# Altium schematic sheet OTHER.SchDoc
size 420 x 297 mm; SheetNumber: 2; SheetTotal: 2
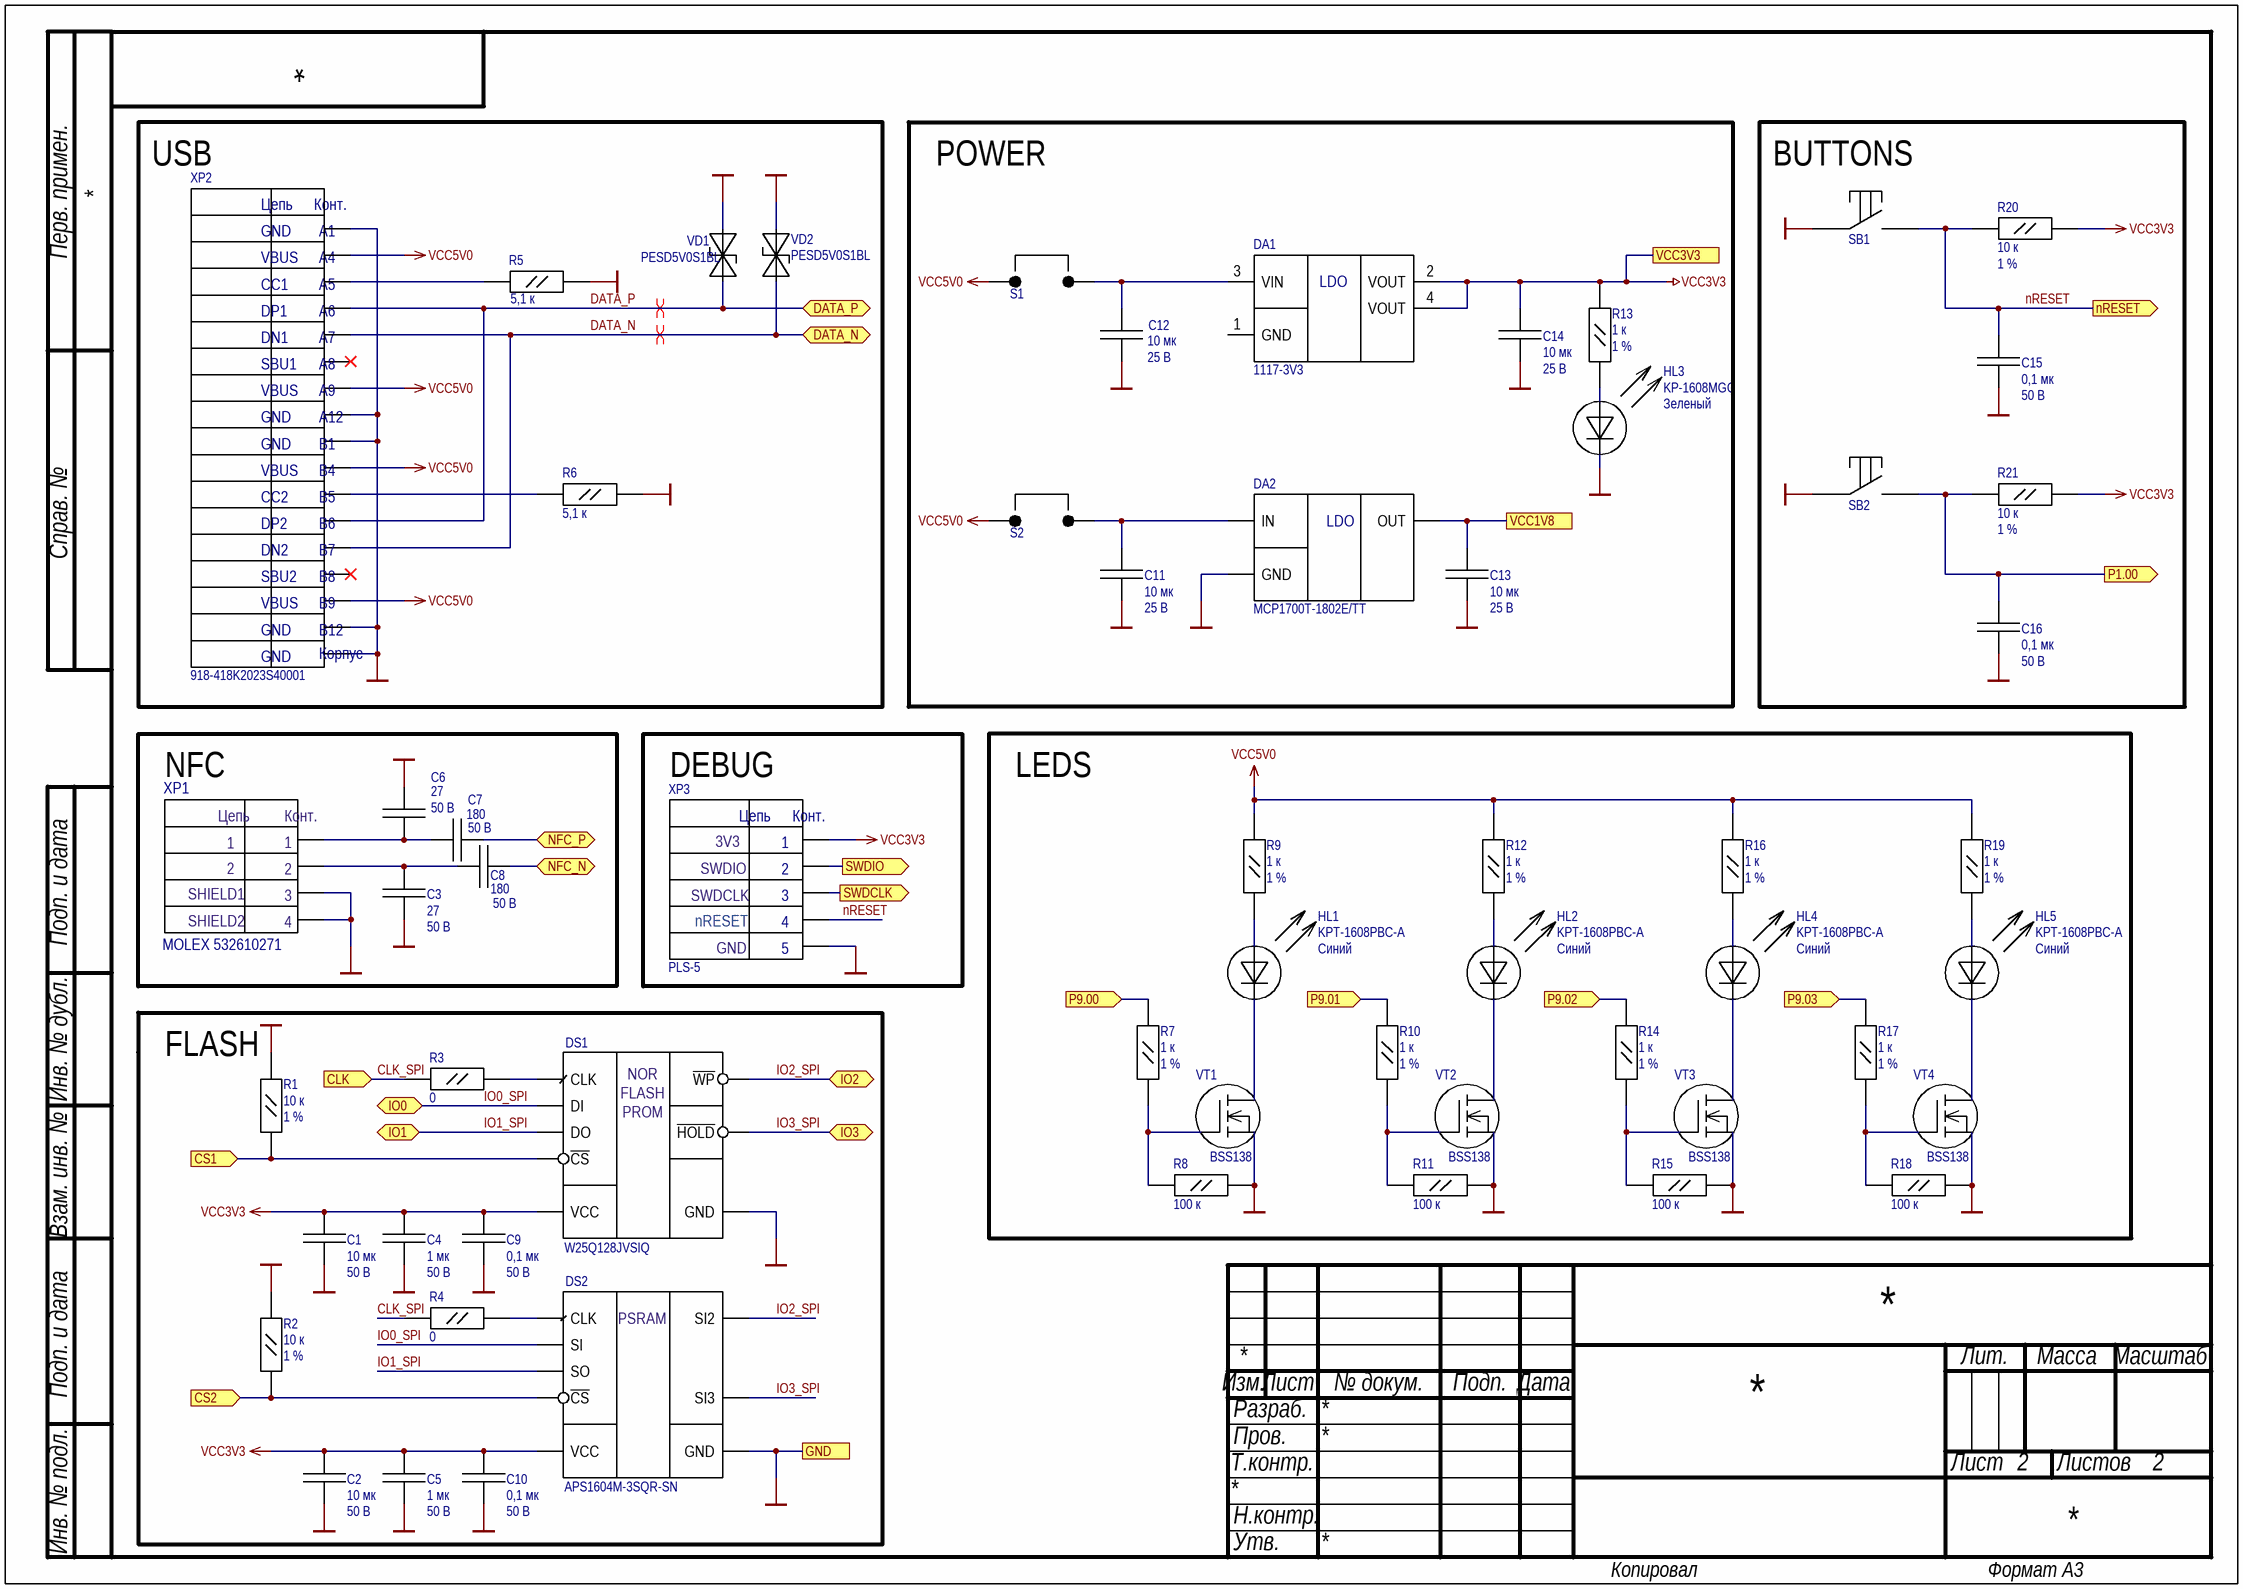
[diagram p0: OTHER.SchDoc]

## Parts
C1  value 10 мк  Rated voltage: 50 В  [C_1210_Manual_mount]  (hidden comment: GRM32ER61H106MA12)
C2  value 10 мк  Rated voltage: 50 В  [C_1210_Manual_mount]  (hidden comment: GRM32ER61H106MA12)
C3  value 27  Rated voltage: 50 В  [C_0603_Manual_mount]  (hidden comment: GRM1885C1H270JA01)
C4  value 1 мк  Rated voltage: 50 В  [C_1206_Manual_mount]  (hidden comment: GRM31MR71H105KA88)
C5  value 1 мк  Rated voltage: 50 В  [C_1206_Manual_mount]  (hidden comment: GRM31MR71H105KA88)
C6  value 27  Rated voltage: 50 В  [C_0603_Manual_mount]  (hidden comment: GRM1885C1H270JA01)
C7  value 180  Rated voltage: 50 В  [C_0603_Manual_mount]  (hidden comment: GRM1885C1H181JA01)
C8  value 180  Rated voltage: 50 В  [C_0603_Manual_mount]  (hidden comment: GRM1885C1H181JA01)
C9  value 0,1 мк  Rated voltage: 50 В  [C_0603_Manual_mount]  (hidden comment: GRM188R71H104KA93)
C10  value 0,1 мк  Rated voltage: 50 В  [C_0603_Manual_mount]  (hidden comment: GRM188R71H104KA93)
C11  value 10 мк  Rated voltage: 25 В  [C_0603_Manual_mount]  (hidden comment: GRM188R61E106MA73)
C12  value 10 мк  Rated voltage: 25 В  [C_0603_Manual_mount]  (hidden comment: GRM188R61E106MA73)
C13  value 10 мк  Rated voltage: 25 В  [C_0603_Manual_mount]  (hidden comment: GRM188R61E106MA73)
C14  value 10 мк  Rated voltage: 25 В  [C_0603_Manual_mount]  (hidden comment: GRM188R61E106MA73)
C15  value 0,1 мк  Rated voltage: 50 В  [C_0603_Manual_mount]  (hidden comment: GRM188R71H104KA93)
C16  value 0,1 мк  Rated voltage: 50 В  [C_0603_Manual_mount]  (hidden comment: GRM188R71H104KA93)
DA1  1117-3V3  [SOT-223]
DA2  MCP1700T-1802E/TT  [SOT-23]
DS1  W25Q128JVSIQ  [SOIC127P790X216-8N]
DS2  APS1604M-3SQR-SN  [APS1604M (SOP-8)]
HL1  KPT-1608PBC-A  Color: Синий  [LED_0603_Blue_Auto_mount]
HL2  KPT-1608PBC-A  Color: Синий  [LED_0603_Blue_Auto_mount]
HL3  KP-1608MGC  Color: Зеленый  [LED_0603_Green_Auto_mount]
HL4  KPT-1608PBC-A  Color: Синий  [LED_0603_Blue_Auto_mount]
HL5  KPT-1608PBC-A  Color: Синий  [LED_0603_Blue_Auto_mount]
R1  value 10 к  Tolerance: 1 %  [R_0603_Manual_mount]  (hidden comment: RC0603FR-0710KL)
R2  value 10 к  Tolerance: 1 %  [R_0603_Manual_mount]  (hidden comment: RC0603FR-0710KL)
R3  value 0  [R_0603_Manual_mount]  (hidden comment: RC0603JR-070RL)
R4  value 0  [R_0603_Manual_mount]  (hidden comment: RC0603JR-070RL)
R5  value 5,1 к  [R_0603_Manual_mount]  (hidden comment: RC0603JR-075K1L)
R6  value 5,1 к  [R_0603_Manual_mount]  (hidden comment: RC0603JR-075K1L)
R7  value 1 к  Tolerance: 1 %  [R_0603_Manual_mount]  (hidden comment: RC0603FR-071KL)
R8  value 100 к  [R_0603_Manual_mount]  (hidden comment: RC0603JR-07100KL)
R9  value 1 к  Tolerance: 1 %  [R_0603_Manual_mount]  (hidden comment: RC0603FR-071KL)
R10  value 1 к  Tolerance: 1 %  [R_0603_Manual_mount]  (hidden comment: RC0603FR-071KL)
R11  value 100 к  [R_0603_Manual_mount]  (hidden comment: RC0603JR-07100KL)
R12  value 1 к  Tolerance: 1 %  [R_0603_Manual_mount]  (hidden comment: RC0603FR-071KL)
R13  value 1 к  Tolerance: 1 %  [R_0603_Manual_mount]  (hidden comment: RC0603FR-071KL)
R14  value 1 к  Tolerance: 1 %  [R_0603_Manual_mount]  (hidden comment: RC0603FR-071KL)
R15  value 100 к  [R_0603_Manual_mount]  (hidden comment: RC0603JR-07100KL)
R16  value 1 к  Tolerance: 1 %  [R_0603_Manual_mount]  (hidden comment: RC0603FR-071KL)
R17  value 1 к  Tolerance: 1 %  [R_0603_Manual_mount]  (hidden comment: RC0603FR-071KL)
R18  value 100 к  [R_0603_Manual_mount]  (hidden comment: RC0603JR-07100KL)
R19  value 1 к  Tolerance: 1 %  [R_0603_Manual_mount]  (hidden comment: RC0603FR-071KL)
R20  value 10 к  Tolerance: 1 %  [R_0603_Manual_mount]  (hidden comment: RC0603FR-0710KL)
R21  value 10 к  Tolerance: 1 %  [R_0603_Manual_mount]  (hidden comment: RC0603FR-0710KL)
S1  0  [Wedge Jumper 0603]  (value not drawn)  (no BOM)
S2  0  [Wedge Jumper 0603]  (value not drawn)  (no BOM)
SB1  Tact_switch  [Tact_switch_6x6x4.3]  (value not drawn)
SB2  Tact_switch  [Tact_switch_6x6x4.3]  (value not drawn)
VD1  PESD5V0S1BL  [SOD-882]
VD2  PESD5V0S1BL  [SOD-882]
VT1  BSS138  [SOT-23]
VT2  BSS138  [SOT-23]
VT3  BSS138  [SOT-23]
VT4  BSS138  [SOT-23]
XP1  MOLEX 532610271  [MOLEX_532610271]
XP2  918-418K2023S40001  [918-418K2023S40001]
XP3  PLS-5  [PLS-5]

## Blocks framed on the sheet
USB: R5 R6 VD1 VD2 XP2
POWER: C11-C14 DA1 DA2 HL3 R13 S1 S2
BUTTONS: C15 C16 R20 R21 SB1 SB2
NFC: C3 C6-C8 XP1
DEBUG: XP3
LEDS: HL1 HL2 HL4 HL5 R7-R12 R14-R19 VT1-VT4
FLASH: C1 C2 C4 C5 C9 C10 DS1 DS2 R1-R4

## Ports
CLK (in, see MCU+GPIO), CS1 (in, see MCU+GPIO), CS2 (in, see MCU+GPIO), DATA_N (bidir, see MCU+GPIO), DATA_P (bidir, see MCU+GPIO), GND (see MCU+GPIO), IO0 (bidir, see MCU+GPIO), IO1 (bidir, see MCU+GPIO), IO2 (bidir, see MCU+GPIO), IO3 (bidir, see MCU+GPIO), NFC_N (bidir, see MCU+GPIO), NFC_P (bidir, see MCU+GPIO), nRESET (out, see MCU+GPIO), P1.00 (out, see MCU+GPIO), P9.00 (in, see MCU+GPIO), P9.01 (in, see MCU+GPIO), P9.02 (in, see MCU+GPIO), P9.03 (in, see MCU+GPIO), SWDCLK (out, see MCU+GPIO), SWDIO (out, see MCU+GPIO), VCC1V8 (see MCU+GPIO), VCC3V3 (see MCU+GPIO)

## Nets
GND: C1.2 C2.2 C3.2 C4.2 C5.2 C6.1 C9.2 C10.2 C11.2 C12.2 C13.2 C14.2 C15.2 C16.2 DA2.1(GND) DS1.4(GND) DS2.4(GND) HL3.C R1.2 R2.2 R5.2 R6.2 R8.2 R11.2 R15.2 R18.2 SB1.1 SB2.1 VD1.1 VD2.1 VT1.2(S) VT2.2(S) VT3.2(S) VT4.2(S) XP1.S1(SHIELD1) XP1.S2(SHIELD2) XP2.0 XP2.A1 XP2.A12 XP2.B1 XP2.B12 XP3.5 ; port GND
VCC3V3: C1.1 C2.1 C4.1 C5.1 C9.1 C10.1 C14.1 DA1.2(VOUT) DA1.4(VOUT) DS1.8(VCC) DS2.8(VCC) R13.1 R20.2 R21.2 XP3.1 ; port VCC3V3
VCC5V0: R9.1 R12.1 R16.1 R19.1 S1.1 S2.1 XP2.A4 XP2.A9 XP2.B4 XP2.B9
CLK_SPI: R3.1 R4.1 ; port CLK
CS1: DS1.1(~{CS}) R1.1 ; port CS1
CS2: DS2.1(~{CS}) R2.1 ; port CS2
DATA_N: VD2.2 XP2.A7 XP2.B7 ; port DATA_N
DATA_P: VD1.2 XP2.A6 XP2.B6 ; port DATA_P
IO0_SPI: DS1.5(DI) DS2.5(SI) ; port IO0
IO1_SPI: DS1.2(DO) DS2.2(SO) ; port IO1
IO2_SPI: DS1.3(~{WP}) DS2.3(SI2) ; port IO2
IO3_SPI: DS1.7(~{HOLD}) DS2.7(SI3) ; port IO3
NFC_N: C8.1 ; port NFC_N
NFC_P: C7.1 ; port NFC_P
nRESET: C15.1 R20.1 SB1.2 XP3.4 ; port nRESET
P1.00: C16.1 R21.1 SB2.2 ; port P1.00
P9.00: R7.1 ; port P9.00
P9.01: R10.1 ; port P9.01
P9.02: R14.1 ; port P9.02
P9.03: R17.1 ; port P9.03
SWDCLK: XP3.3 ; port SWDCLK
SWDIO: XP3.2 ; port SWDIO
VCC1V8: C13.1 DA2.2(OUT) ; port VCC1V8
NetC3_1: C3.1 C8.2 XP1.2
NetC6_2: C6.2 C7.2 XP1.1
NetC11_1: C11.1 DA2.3(IN) S2.2
NetC12_1: C12.1 DA1.3(VIN) S1.2
NetDS1_6: DS1.6(CLK) R3.2
NetDS2_6: DS2.6(CLK) R4.2
NetHL1_A: HL1.A R9.2
NetHL1_C: HL1.C VT1.3(D)
NetHL2_A: HL2.A R12.2
NetHL2_C: HL2.C VT2.3(D)
NetHL3_A: HL3.A R13.2
NetHL4_A: HL4.A R16.2
NetHL4_C: HL4.C VT3.3(D)
NetHL5_A: HL5.A R19.2
NetHL5_C: HL5.C VT4.3(D)
NetR5_1: R5.1 XP2.A5
NetR6_1: R6.1 XP2.B5
NetR7_2: R7.2 R8.1 VT1.1(G)
NetR10_2: R10.2 R11.1 VT2.1(G)
NetR14_2: R14.2 R15.1 VT3.1(G)
NetR17_2: R17.2 R18.1 VT4.1(G)

Not connected (* = marked no-connect by the designer): DA1 1(GND); XP2 A8* B8*

## Layout directives
differential pair; differential pair class USB: DATA_N, DATA_P

## Notes on the sheet
- 1
- 3V3
- (near XP1) SHIELD1
- (near XP1) SHIELD2
- 2
- SWDCLK
- nRESET
- SWDIO
- GND
- Перв. примен.
- Справ. №
- Подп. и дата
- Инв. № дубл.
- Взам. инв. №
- Изм.
- Лист
- № докум.
- Подп.
- Дата
- Лит.
- Масса
- Масштаб
- Т.контр.
- Пров.
- Разраб.
- Листов
- Инв. № подл.
- Н.контр.
- Утв.
- Копировал
- Формат А3
- (in symbol 918-418K2023S40001) Цепь; Конт.; GND; VBUS; CC1; DP1; DN1; SBU1; CC2; DP2; DN2; SBU2; Корпус
- (in symbol 1117-3V3) LDO
- (in symbol 532610271) Цепь; Конт.; 3; 4
- (in symbol MCP1700T-1802E/TT) LDO
- (in symbol PLS-5) Цепь; Конт.
- (in symbol W25Q128JVSIQ) NOR / FLASH / PROM /

## Library data of the parts
C1 C2 = GRM32ER61H106MA12: Chip Monolithic Ceramic Capacitor; Manufacturer: Murata Manufacturing; Tolerance: 20 %; Temperature coefficient: ±15 %; Type: Конденсатор керамический; TC: X5R; Size: 1210; Temperature range: -55 ... 85 °C; Part Number: GRM32ER61H106MA12
C3 C6 = GRM1885C1H270JA01: Chip Monolithic Ceramic Capacitor; Manufacturer: Murata Manufacturing; Tolerance: 5 %; Temperature coefficient: ±30 ppm/°C; Type: Конденсатор керамический; TC: C0G; Size: 0603; Temperature range: -55 ... 125 °C; Part Number: GRM1885C1H270JA01
C4 C5 = GRM31MR71H105KA88: Chip Monolithic Ceramic Capacitor; Manufacturer: Murata Manufacturing; Tolerance: 10 %; Temperature coefficient: ±15 %; Type: Конденсатор керамический; TC: X7R; Size: 1206; Temperature range: -55 ... 125 °C; Part Number: GRM31MR71H105KA88
C7 C8 = GRM1885C1H181JA01: Chip Monolithic Ceramic Capacitor; Manufacturer: Murata Manufacturing; Tolerance: 5 %; Temperature coefficient: ±30 ppm/°C; Type: Конденсатор керамический; TC: C0G; Size: 0603; Temperature range: -55 ... 125 °C; Part Number: GRM1885C1H181JA01
C9 C10 C15 C16 = GRM188R71H104KA93: Chip Monolithic Ceramic Capacitor; Manufacturer: Murata Manufacturing; Tolerance: 10 %; Temperature coefficient: ±15 %; Type: Конденсатор керамический; TC: X7R; Size: 0603; Temperature range: -55 ... 125 °C; Part Number: GRM188R71H104KA93
C11-C14 = GRM188R61E106MA73: Chip Monolithic Ceramic Capacitor; Manufacturer: Murata Manufacturing; Tolerance: 20 %; Temperature coefficient: ±15 %; Type: Конденсатор керамический; TC: X5R; Size: 0603; Temperature range: -55 ... 85 °C; Part Number: GRM188R61E106MA73
DA1 = 1117-3V3: LOW DROP LINEAR VOLTAGE REGULATORS; Manufacturer: Hottech; Input voltage: 5 ... 12 В; Output current: 1 А; Type: Линейный регулятор напряжения; Temperature range: -40 ... 125 °C; Datasheet: https://static.chipdip.ru/lib/801/DOC059801903.pdf
DA2 = MCP1700T-1802E/TT: Low Quiescent Current LDO; Manufacturer: Microchip Technology; Output voltage: 1,8 В; Max. output current: 200 мА; Input voltage: 2,3...6 В; Dropout voltage: 150 мВ; Type: Линейный регулятор напряжения с низким падением; Temperature range: -40 ... 125 °C
DS1 = W25Q128JVSIQ: FLASH - NOR Memory IC 128Mb (16M x 8) SPI - Quad I/O, QPI, DTR 133 MHz 8-SOIC; Manufacturer: Winbond; Type: Микросхема памяти; Type of memory: NOR FLASH PROM; Capacity: 128 Мбит; Interface: SPI/QSPI; Package type: SOIC-8
DS2 = APS1604M-3SQR-SN: Manufacturer: AP Memory; Type: Микросхема памяти; Type of memory: PSRAM; Capacity: 16 Мбит; Interface: SPI/QPI; Package type: TSOP-8
HL1 HL2 HL4 HL5 = KPT-1608PBC-A: SMD LED; Manufacturer: Kingbright; Forward voltage: 3,2 В; Power dissitipation: 120 мВт; Type: Светодиод; Max. forward current: 30 мА; Max. reverse voltage: 5 В; Size: 0603; Temperature range: -40 ... 85 °C
HL3 = KP-1608MGC: SMD LED; Manufacturer: Kingbright; Forward voltage: 2,1 В; Power dissitipation: 75 мВт; Type: Светодиод; Max. forward current: 30 мА; Max. reverse voltage: 5 В; Size: 0603; Temperature range: -40 ... 85 °C
R1 R2 R20 R21 = RC0603FR-0710KL: General Purpose Chip Resistor; Manufacturer: YAGEO; Power dissipation: 0,1 Вт; Temperature coefficient: ±100 ppm/°C; Size: 0603; Temperature range: -55 ... 155 °C; Type: Резистор постоянный; Part Number: RC0603FR-0710KL
R3 R4 = RC0603JR-070RL: General Purpose Chip Resistor; Manufacturer: YAGEO; Tolerance: 5 %; Rated current: 1 А; Maximum current: 2 A; Size: 0603; Temperature range: -55 ... 155 °C; Type: Перемычка контактная SMD; Part Number: RC0603JR-070RL
R5 R6 = RC0603JR-075K1L: General Purpose Chip Resistor; Manufacturer: YAGEO; Tolerance: 5 %; Power dissipation: 0,1 Вт; Temperature coefficient: ±100 ppm/°C; Size: 0603; Temperature range: -55 ... 155 °C; Type: Резистор постоянный; Part Number: RC0603JR-075K1L
R7 R9 R10 R12-R14 R16 R17 R19 = RC0603FR-071KL: General Purpose Chip Resistor; Manufacturer: YAGEO; Power dissipation: 0,1 Вт; Temperature coefficient: ±100 ppm/°C; Size: 0603; Temperature range: -55 ... 155 °C; Type: Резистор постоянный; Part Number: RC0603FR-071KL
R8 R11 R15 R18 = RC0603JR-07100KL: General Purpose Chip Resistor; Manufacturer: YAGEO; Tolerance: 5 %; Power dissipation: 0,1 Вт; Temperature coefficient: ±100 ppm/°C; Size: 0603; Temperature range: -55 ... 155 °C; Type: Резистор постоянный; Part Number: RC0603JR-07100KL
S1 S2 = Wedge jumper: Type: Перемычка
SB1 SB2 = Tact_switch: SMD pushbutton; Manufacturer: NONAME; Junction resistance: 100 мОм; Rated voltage: 12 В; Rated current: 50 мА; Life cycles: 100000; Type: Выключатель кнопочный с самовозвратом
VD1 VD2 = PESD5V0S1BL: Low capacitance bidirectional ESD protection diodes; Manufacturer: NXP; Type: Защитный диод; Input capacitance: 35 пФ; Clamping voltage: 14 В; Breakdown voltage: 5,5 ... 9,5 В; Peak pulse power: 130 Вт; Temperature range: -60 ... 150 °C
VT1-VT4 = BSS138: N-Channel Logic Level Enhancement Mode Field Effect Transistor; Manufacturer: Fairchild Semiconductor; Structure: Индуцированный канал n-типа; Type: Транзистор полевой с изолированным затвором; Max gate-to-source voltage: 20 В; Drain-to-source breakdown voltage: 50 В; Gate threshold voltage: 1,3 В; Max continuous drain current: 220 мА; Max pulsed drain current: 880 мА; Power dissitipation: 0,36 Вт; Input capacitance: 27 пФ; Output capacitance: 13 пФ; Turn-on time: 15 нс; Reverse transfer capacitance: 6 пФ; Turn-off time: 27 нс; Rds: 6 Ом; Forward transconductance: 500 мА/В; Temperature range: -55 ... 150 °C
XP1 = 532610271: Connector Header Surface Mount, Right Angle 2 position 0.049 (1.25mm); Connector type: Вилка на плату; Number of contacts: 2; Manufacturer: MOLEX; Type: Разъем штыревой
XP2 = 918-418K2023S40001: Female Type-C SMD USB Connectors; Manufacturer: JING; Number of contacts: 16; Type: Type-C
XP3 = PLS-5: PLS connector; Manufacturer: NONAME; Connector type: Вилка на плату; Number of contacts: 5; Type: Разъем штыревой